# Altium schematic sheet Power.SchDoc
size Tabloid; DocumentNumber: 2; SheetNumber: 2; SheetTotal: 11; SheetName: Main power supply; Size: 11x17; Sheet_Name: Power
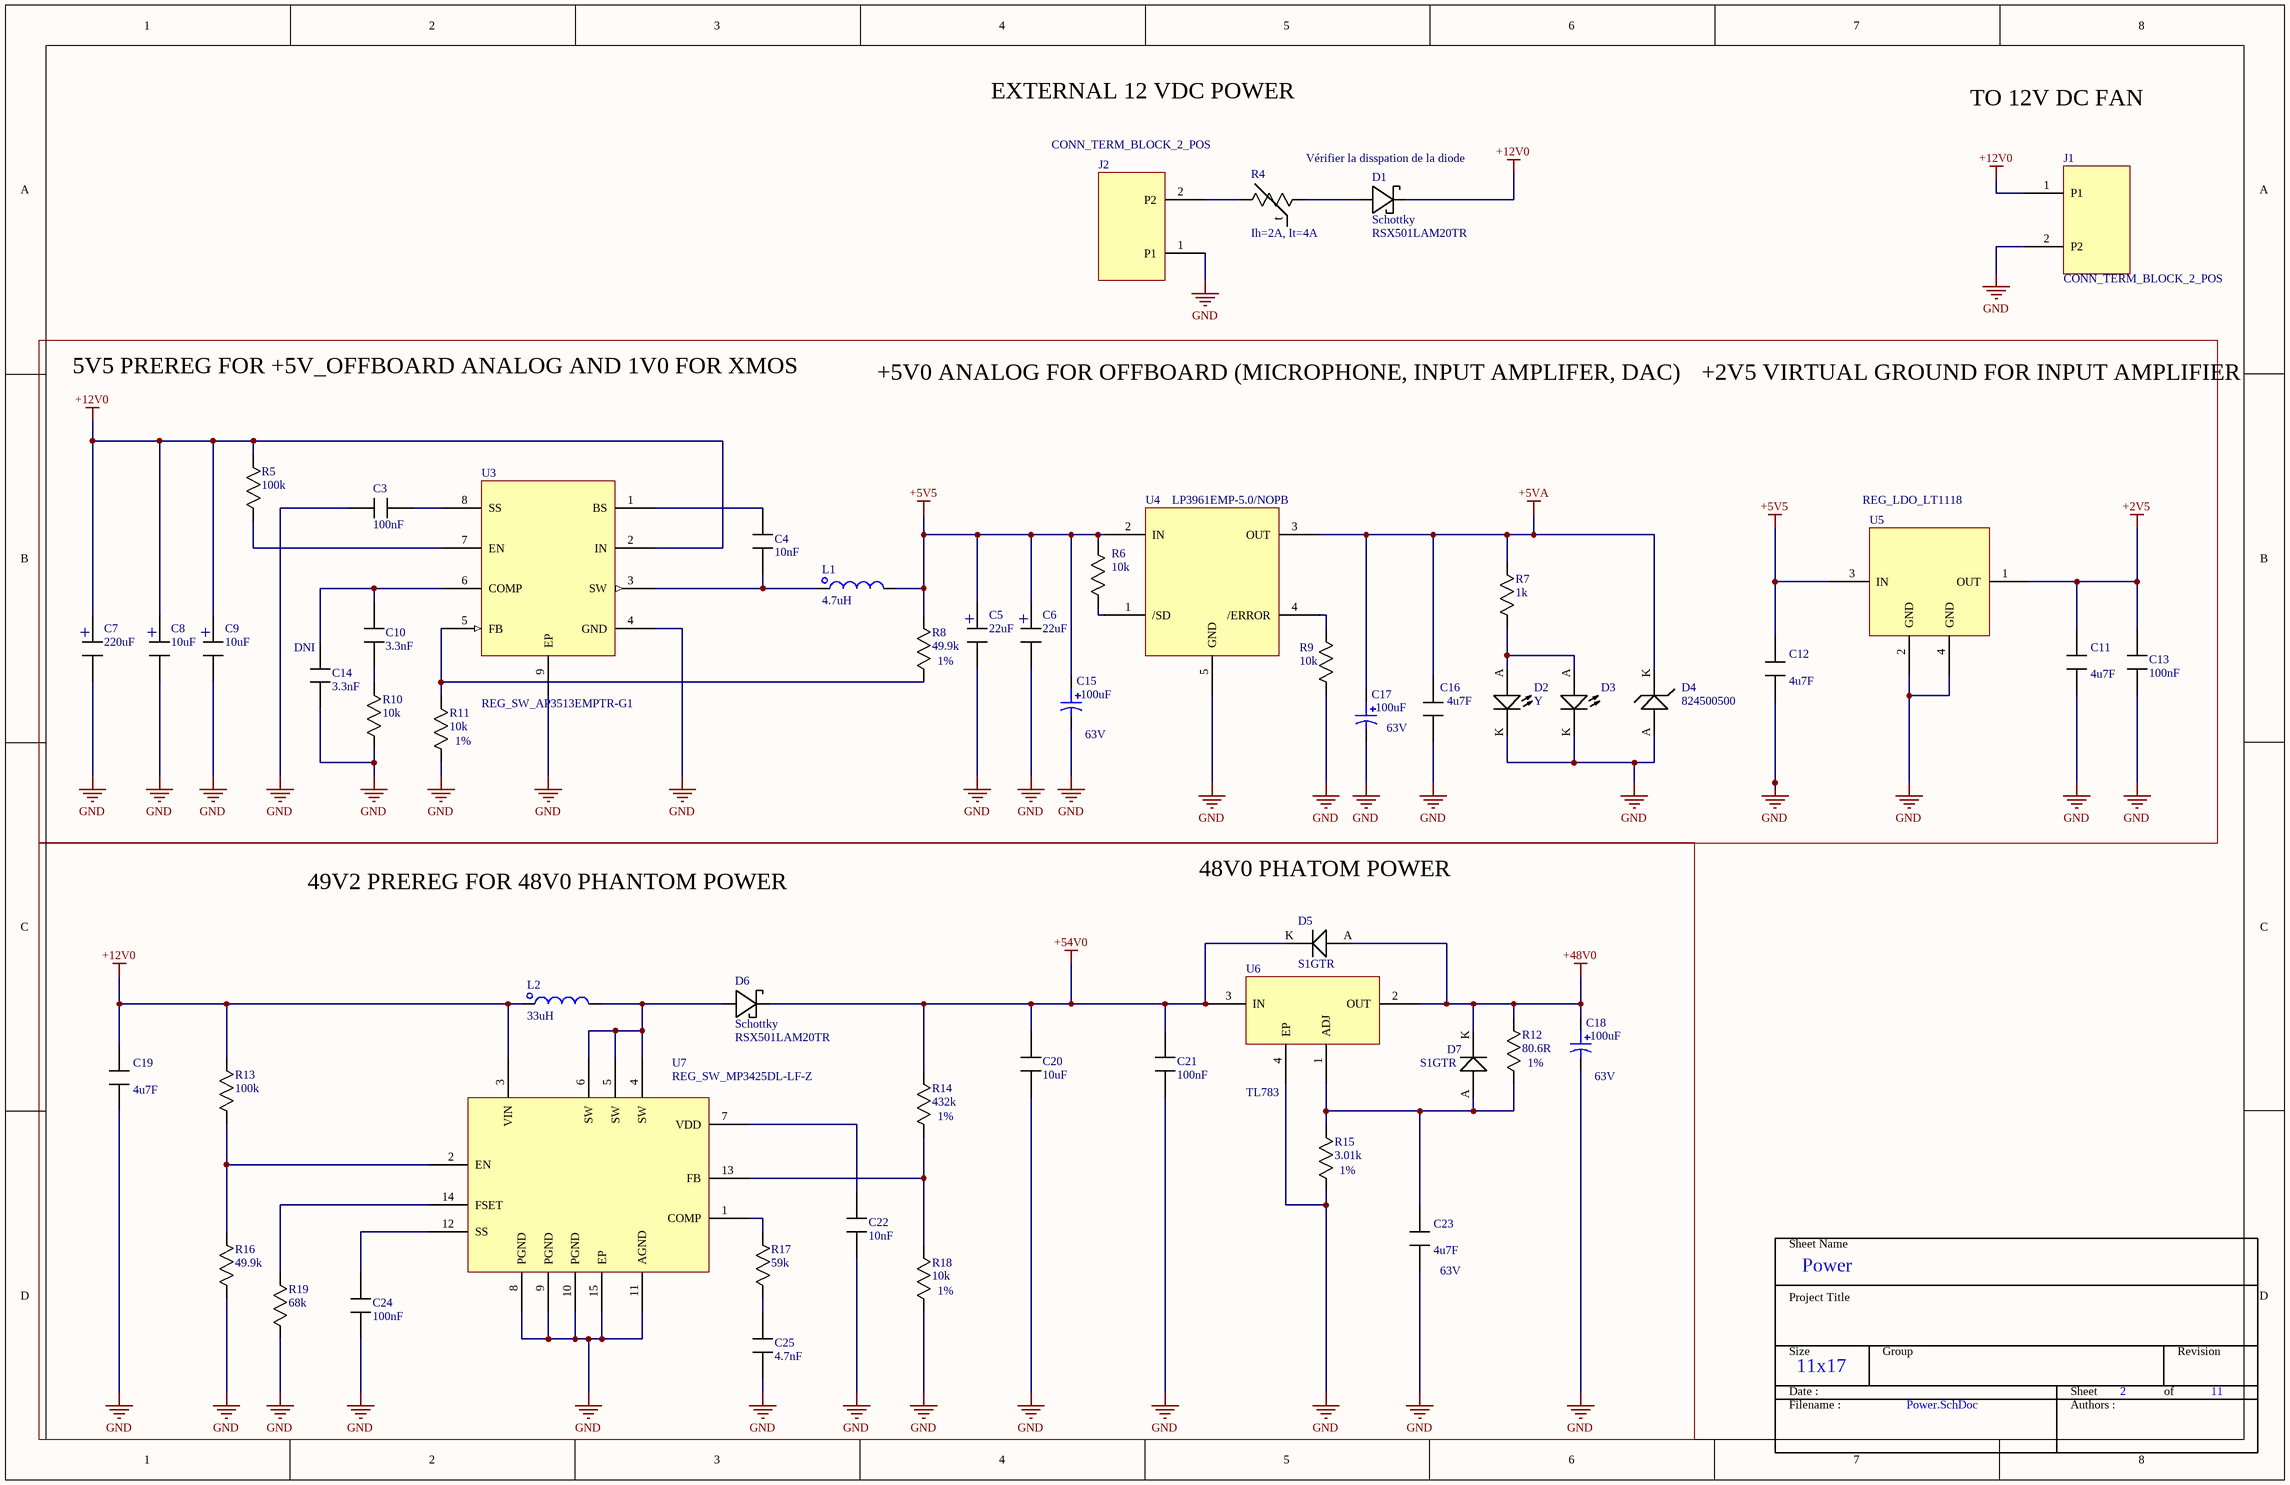
[diagram p0: Power.SchDoc]

## Parts
C3  value 100nF  [0603]  (hidden comment: Capacitor)
C4  value 10nF  [0603]  (hidden comment: Capacitor)
C5  value 22uF  [CAP_RAD_SMD_DIA157]  (hidden comment: Capacitor_Polarized)
C6  value 22uF  [CAP_RAD_SMD_DIA157]  (hidden comment: Capacitor_Polarized)
C7  value 220uF  [CAP_RAD_SMD_DIA315]  (hidden comment: Capacitor_Polarized)
C8  value 10uF  [CAP_RAD_SMD_DIA157]  (hidden comment: Capacitor_Polarized)
C9  value 10uF  [CAP_RAD_SMD_DIA157]  (hidden comment: Capacitor_Polarized)
C10  value 3.3nF  [0603]  (hidden comment: Capacitor)
C11  value 4u7F  [0805]  (hidden comment: Capacitor)
C12  value 4u7F  [0805]  (hidden comment: Capacitor)
C13  value 100nF  [0603]  (hidden comment: Capacitor)
C14  value 3.3nF  note: DNI  [0603]  (hidden comment: Capacitor)
C15  value 100uF  Voltage: 63V  [CAP_ALU_1010_vishay]  (hidden comment: MAL215099101E3)
C16  value 4u7F  [0603]  (hidden comment: Capacitor)
C17  value 100uF  Voltage: 63V  [CAP_ALU_1010_vishay]  (hidden comment: MAL215099101E3)
C18  value 100uF  Voltage: 63V  [CAP_ALU_1010_vishay]  (hidden comment: MAL215099101E3)
C19  value 4u7F  [0805]  (hidden comment: Capacitor)
C20  value 10uF  [CAP_1210]  (hidden comment: Capacitor)
C21  value 100nF  [0603]  (hidden comment: Capacitor)
C22  value 10nF  [0603]  (hidden comment: Capacitor)
C23  value 4u7F  voltage: 63V  [0603]  (hidden comment: Capacitor)
C24  value 100nF  [0603]  (hidden comment: Capacitor)
C25  value 4.7nF  [0603]  (hidden comment: Capacitor)
D1  Schottky  Mfg Part Number: RSX501LAM20TR  [SOD-123F]
D2  Type: Y  [0805_LED]  (hidden comment: Diode_LED)
D3  Diode_LED  [0805_LED]  (value not drawn)
D4  Mfg_PN: 824500500  [DIODE_DO-214AC/SMA]  (hidden comment: Diode_zener)
D5  Mfg_PN: S1GTR  [DIODE_SMA]  (hidden comment: Diode)
D6  Schottky  Mfg Part Number: RSX501LAM20TR  [SOD-123F]
D7  Mfg_PN: S1GTR  [DIODE_SMA]  (hidden comment: Diode)
J1  CONN_TERM_BLOCK_2_POS  [TERM BLOCK]
J2  CONN_TERM_BLOCK_2_POS  [TERM BLOCK]
L1  value 4.7uH  [IND_252012CDMC/DS]  (hidden comment: Inductor)
L2  value 33uH  [IND_252012CDMC/DS]  (hidden comment: Inductor)
R4  value Ih=2A, It=4A  [1206_PTC]  (hidden comment: Resistor_PTC)
R5  value 100k  [0603]  (hidden comment: Resistor)
R6  value 10k  [0603]  (hidden comment: Resistor)
R7  value 1k  [0603]  (hidden comment: Resistor)
R8  value 49.9k  Tolerance: 1%  [0603]  (hidden comment: Resistor)
R9  value 10k  [0603]  (hidden comment: Resistor)
R10  value 10k  [0603]  (hidden comment: Resistor)
R11  value 10k  Tolerance: 1%  [0603]  (hidden comment: Resistor)
R12  value 80.6R  Tolerance: 1%  [0603]  (hidden comment: Resistor)
R13  value 100k  [0603]  (hidden comment: Resistor)
R14  value 432k  Tolerance: 1%  [0603]  (hidden comment: Resistor)
R15  value 3.01k  Tolerance: 1%  [0603]  (hidden comment: Resistor)
R16  value 49.9k  [0603]  (hidden comment: Resistor)
R17  value 59k  [0603]  (hidden comment: Resistor)
R18  value 10k  Tolerance: 1%  [0603]  (hidden comment: Resistor)
R19  value 68k  [0603]  (hidden comment: Resistor)
U3  REG_SW_AP3513EMPTR-G1  [AP3513EMPTR-G1]
U4  LP3961EMP-5.0/NOPB  [TL783]
U5  REG_LDO_LT1118  [SOT-223-3]
U6  TL783  [TL783]
U7  REG_SW_MP3425DL-LF-Z  [14-VFDFN Exposed Pad]

## Nets
+2V5: C11.1 C13.2 U5.1(OUT)
+5V5: C5.+ C6.+ C12.1 C15.1 L1.2 R6.1 R8.1 U4.2(IN) U5.3(IN)
+5VA: C16.1 C17.1 D4.K R7.2 U4.3(OUT)
+12V0: C7.+ C8.+ C9.+ C19.1 D1.2(cathode) J1.1(P1) L2.1 R5.2 R13.2 U3.2(IN) U7.3(VIN)
+48V0: C18.1 D5.A D7.K R12.1 U6.2(OUT)
+54V0: C20.1 C21.2 D5.K D6.2(cathode) R14.1 U6.3(IN)
GND: C3.1 C5.- C6.- C7.- C8.- C9.- C11.2 C12.2 C13.1 C14.2 C15.2 C16.2 C17.2 C18.2 C19.2 C20.2 C21.1 C22.2 C23.2 C24.1 C25.2 D2.K D3.K D4.A J1.2(P2) J2.1(P1) R9.2 R10.2 R11.2 R15.2 R16.2 R18.2 R19.1 U3.4(GND) U3.9(EP) U4.5(GND) U5.2(GND) U5.4(GND) U6.4(EP) U7.8(PGND) U7.9(PGND) U7.10(PGND) U7.11(AGND) U7.15(EP)
NetC3_2: C3.2 U3.8(SS)
NetC4_1: C4.1 U3.1(BS)
NetC4_2: C4.2 L1.1 U3.3(SW)
NetC10_1: C10.1 C14.1 U3.6(COMP)
NetC10_2: C10.2 R10.1
NetC22_1: C22.1 U7.7(VDD)
NetC23_1: C23.1 D7.A R12.2 R15.1 U6.1(ADJ)
NetC24_2: C24.2 U7.12(SS)
NetC25_1: C25.1 R17.2
NetD1_1: D1.1(anode) R4.2
NetD2_A: D2.A D3.A R7.1
NetD6_1: D6.1(anode) L2.2 U7.4(SW) U7.5(SW) U7.6(SW)
NetJ2_2: J2.2(P2) R4.1
NetR5_1: R5.1 U3.7(EN)
NetR6_2: R6.2 U4.1(/SD)
NetR8_2: R8.2 R11.1 U3.5(FB)
NetR9_1: R9.1 U4.4(/ERROR)
NetR13_1: R13.1 R16.1 U7.2(EN)
NetR14_2: R14.2 R18.1 U7.13(FB)
NetR17_1: R17.1 U7.1(COMP)
NetR19_2: R19.2 U7.14(FSET)

## Notes on the sheet
- EXTERNAL 12 VDC POWER
- Vérifier la disspation de la diode
- TO 12V DC FAN
- 5V5 PREREG FOR +5V_OFFBOARD ANALOG AND 1V0 FOR XMOS
- +5V0 ANALOG FOR OFFBOARD (MICROPHONE, INPUT AMPLIFER, DAC)
- +2V5 VIRTUAL GROUND FOR INPUT AMPLIFIER
- 49V2 PREREG FOR 48V0 PHANTOM POWER
- 48V0 PHATOM POWER
- Sheet Name
- Project Title
- Size
- Group
- Revision
- Date :
- Filename :
- Sheet
- Authors :
- of
- (in symbol Resistor_PTC) t

## Library data of the parts
C3 C13 C24 = Capacitor: Mfg: Samsung; Mfg_PN: CL10F104ZO8NNNC; HelpURL: *; NI: NI; Supplier1: Digikey; Supplier1_PN: 1276-1258-1-ND; Tolerance: *; Type: *; Rating: *
C4 C22 = Capacitor: Mfg: Samsung; Mfg_PN: CL10B102KB8NNNC; HelpURL: https://www.digikey.ca/product-detail/en/samsung-electro-mechanics/CL10B102KB8NNNC/1276-1018-1-ND/3889104; NI: NI; Supplier1: Digikey; Supplier1_PN: 1276-1018-1-ND; Tolerance: *; Type: *; Rating: *
C5 = Capacitor_Polarized: Capacitor; Mfg: Panasonic; Mfg_PN: Part Number EEE-FT1V220AR; HelpURL: *; NI: *; Supplier1: Digikey; Supplier1_PN: PCE5012CT-ND; Tolerance: *; Type: *; Rating: *
C6 = Capacitor_Polarized: Capacitor; Mfg: Panasonic; Mfg_PN: EEE-FT1V220AR; HelpURL: *; NI: *; Supplier1: Digikey; Supplier1_PN: PCE5012CT-ND; Tolerance: *; Type: *; Rating: *
C7 = Capacitor_Polarized_1: Capacitor; Mfg: Nichicon; Mfg_PN: UWT1E221MNL1GS; HelpURL: *; NI: *; Supplier1: Digikey; Supplier1_PN: 493-2192-1-ND; Tolerance: *; Type: *; Rating: *
C8 C9 = Capacitor_Polarized: Capacitor; Mfg: Nichicon; Mfg_PN: UWX1C100MCL1GB; HelpURL: *; NI: *; Supplier1: Digikey; Supplier1_PN: 493-2100-1-ND; Tolerance: *; Type: *; Rating: *
C10 C14 = Capacitor: Mfg: Samsung; Mfg_PN: CL10B332JB8NNNC; HelpURL: *; NI: NI; Supplier1: Digikey; Supplier1_PN: 1276-2030-1-ND; Tolerance: *; Type: *; Rating: *
C11 C12 C16 C19 = Capacitor: Mfg: Samsung; Mfg_PN: CL21A475KAQNNNG; HelpURL: *; NI: *; Supplier1: Digikey; Supplier1_PN: 1276-6462-1-ND; Tolerance: *; Type: *; Rating: *
C15 C17 C18 = CAP_ALU_MAL215099101E3: CAP - ALU 100uF 20% 50V - 1010; Mfg Part Number: UUX1J101MNL1GS; Mfg: Nichicon; CreatedBy: Jonathan Bouchard; Temperature: -55°C to 125°C; Power: *; Supplier 1: Digikey; Supplier Part Number 1: 4399PHDKR-ND; Package: 1010; Precision: 20%; Supplier Part Number: *; Supplier Part Number: 493-7453-1-ND
C20 = Capacitor: Mfg: Samsung; Mfg_PN: CL32B106KMVNNWE; HelpURL: https://www.digikey.ca/product-detail/en/samsung-electro-mechanics/CL32B106KMVNNWE/1276-7053-1-ND/7320695; NI: NI; Supplier1: Digikey; Supplier1_PN: 1276-7053-1-ND; Tolerance: *; Type: *; Rating: *
C21 = Capacitor: Mfg: Walsin; Mfg_PN: 0603B104K101CT; HelpURL: *; NI: NI; Supplier1: Digikey; Supplier1_PN: 1292-1392-1-ND; Tolerance: *; Type: *; Rating: *
C23 = Capacitor: Mfg: Samsung; Mfg_PN: CL10A475MQ8NNNC; HelpURL: *; NI: *; Supplier1: Digikey; Supplier1_PN: 1276-1907-1-ND; Tolerance: *; Type: *; Rating: *
C25 = Capacitor: Mfg: Samsung; Mfg_PN: CL10B472KB8NNNC; HelpURL: https://www.digikey.ca/product-detail/en/samsung-electro-mechanics/CL10B472KB8NNNC/1276-1098-1-ND/3889184; NI: NI; Supplier1: Digikey; Supplier1_PN: 1276-1098-1-ND; Tolerance: *; Type: *; Rating: *
D1 = Schottky: Vf = 390mV, Vr = 20V; Current: 5A; Mfg: Rohm Semiconductor; CreatedBy: Emile Laplante; HelpURL: https://www.digikey.ca/product-detail/en/smc-diode-solutions/DSS16UTR/1655-1929-1-ND/8341871; NI: *; Package: *; Power: *; Supplier: Digikey; Supplier Part Numer: RSX501LAM20CT-ND; Temperature: *; Value: *; VerifiedBy: *; Voltage: *
D2 = Diode_LED: LED; Mfg: Osram; Mfg_PN: LY R976-PS-36; HelpURL: *; NI: *; Supplier1: Digikey; Supplier1_PN: 475-2560-1-ND; Tolerance: *; Rating: *; Value: *
D3 = Diode_LED: LED; Mfg: Osram; Mfg_PN: LY R976-PS-36; Type: Y; HelpURL: *; Supplier1: Digikey; Supplier1_PN: 475-2560-1-ND; Tolerance: *; Rating: *; Value: *
D4 = Diode_zener: Diode; Mfg: Wurth; HelpURL: *; NI: *; Supplier1: Digikey; Supplier1_PN: 732-9974-1-ND; Tolerance: *; Type: *; Rating: *; Value: *
D5 D7 = Diode: Mfg: SMC Diode Solutions; HelpURL: *; NI: *; Supplier1: Digikey; Supplier1_PN: 1655-1504-1-ND; Tolerance: *; Type: *; Rating: *; Value: *
D6 = Schottky: Vf = 390mV, Vr = 20V; Mfg: Rohm Semiconductor; CreatedBy: Emile Laplante; HelpURL: https://www.digikey.ca/product-detail/en/smc-diode-solutions/DSS16UTR/1655-1929-1-ND/8341871; NI: *; Package: *; Power: *; Supplier: Digikey; Supplier Part Numer: RSX501LAM20CT-ND; Temperature: *; Value: *; VerifiedBy: *; Voltage: *
L1 = Inductor: Mfg: Bourns Inc.; Mfg_PN: SRN5040-4R7M; HelpURL: *; NI: *; Rating: *; Tolerance: *; Supplier1: Digikey; Supplier1_PN: SRN5040-4R7MCT-ND
L2 = Inductor: Mfg: TDK Corporation; Mfg_PN: VLS5045EX-330M; HelpURL: https://www.digikey.ca/product-detail/en/tdk-corporation/VLS5045EX-330M/445-174851-1-ND/6560408; NI: *; Rating: *; Tolerance: *; Supplier1: Digikey; Supplier1_PN: 445-174851-1-ND
R4 = Resistor_PTC: Mfg: Littelfuse Inc.; Mfg_PN: 1206L150SLYR; NI: *; Supplier1: Digikey; Supplier1_PN: F3367CT-ND; Type: *; Rating: *; Tolerance: *
R5 R13 = Resistor: Mfg: Stackpole Electronics Inc; Mfg_PN: RMCF0603FT100K; HelpURL: https://www.digikey.ca/product-detail/en/stackpole-electronics-inc/RMCF0603FT100K/RMCF0603FT100KCT-ND/1943118; NI: *; Supplier1: Digikey; Supplier1_PN: RMCF0603FT100KCT-ND; Type: *; Rating: *; Tolerance: *
R6 R9 R10 = Resistor: Mfg: Yageo; Mfg_PN: RC0603JR-0710KL; HelpURL: *; NI: *; Supplier1: Digikey; Supplier1_PN: 311-10KGRCT-ND; Type: *; Rating: *; Tolerance: *
R7 = Resistor: Mfg: Yageo; Mfg_PN: RC0603JR-071KL; HelpURL: *; NI: *; Supplier1: Digikey; Supplier1_PN: 311-1.0KGRCT-ND; Type: *; Rating: *; Tolerance: *
R8 R16 = Resistor: Mfg: Yageo; Mfg_PN: RC0603FR-0749K9L; HelpURL: *; NI: *; Supplier1: Digikey; Supplier1_PN: 311-49.9KHRCT-ND; Type: *; Rating: *
  R16: Tolerance: *
R11 R18 = Resistor: Mfg: Stackpole Electronics Inc; Mfg_PN: RNCP0603FTD10K0; HelpURL: *; NI: *; Supplier1: Digikey; Supplier1_PN: RNCP0603FTD10K0CT-ND; Type: *; Rating: *
R12 = Resistor: Mfg: Stackpole Electronics Inc; Mfg_PN: RMCF0603FT80R6; HelpURL: *; NI: *; Supplier1: Digikey; Supplier1_PN: RMCF0603FT80R6CT-ND; Type: *; Rating: *
R14 = Resistor: Mfg: Yageo; Mfg_PN: RC0603FR-07432KL; HelpURL: *; NI: *; Supplier1: Digikey; Supplier1_PN: 311-432KHRCT-ND; Type: *; Rating: *
R15 = Resistor: Mfg: Panasonic Electronic Components; Mfg_PN: ERJ-3EKF3011V; HelpURL: *; NI: *; Supplier1: Digikey; Supplier1_PN: P3.01KHCT-ND; Type: *; Rating: *
R17 = Resistor: Mfg: Stackpole Electronics Inc; Mfg_PN: RMCF0603FT59K0; HelpURL: https://www.digikey.ca/product-detail/en/stackpole-electronics-inc/RMCF0603FT59K0/RMCF0603FT59K0CT-ND/4425114; NI: *; Supplier1: Digikey; Supplier1_PN: RMCF0603FT59K0CT-ND; Type: *; Rating: *; Tolerance: *
R19 = Resistor: Mfg: Yageo; Mfg_PN: RC0603FR-0768KL; HelpURL: https://www.digikey.ca/product-detail/en/yageo/RC0603FR-0768KL/311-68.0KHRCT-ND/730299; NI: *; Supplier1: Digikey; Supplier1_PN: 311-68.0KHRCT-ND; Type: *; Rating: *; Tolerance: *
U3 = REG_SW_AP3513EMPTR-G1: Mfg: Diodes Incorporated; CreatedBy: Emile Laplante; HelpURL: https://www.digikey.ca/product-detail/en/diodes-incorporated/AP3513EMPTR-G1/AP3513EMPTR-G1DICT-ND/4505181; Mfg Part Number: AP3513EMPTR-G1; NI: *; Power: *; Supplier: Digikey; Supplier Part Numer: AP3513EMPTR-G1DICT-ND; Temperature: *; Value: *; VerifiedBy: *; Voltage: *
U4 = LP3961EMP-5.0/NOPB: Mfg: Texas Instruments; CreatedBy: Emile Laplante; HelpURL: https://www.digikey.ca/product-detail/en/texas-instruments/LP3961EMP-5.0-NOPB/LP3961EMP-5.0-NOPBCT-ND/364674; Mfg Part Number: LP3961EMP-5.0/NOPB; NI: *; Package: *; Power: *; Supplier: Digikey; Supplier Part Numer: LP3961EMP-5.0/NOPBCT-ND; Temperature: *; Value: *; VerifiedBy: *; Voltage: *
U5 = REG_LDO_LT1118: Mfg Part Number: LT1118CST-2.5#PBF; Mfg: Linear Technology/Analog Devices; CreatedBy: Emile Laplante; HelpURL: https://www.digikey.ca/products/en?keywords=LT1118CST-2.5%23PBF; NI: *; Package: SOT-223-3; Power: *; Supplier: Digikey; Supplier Part Numer: LT1118CST-2.5#PBF-ND; Temperature: *; Value: *; VerifiedBy: *; Voltage: *
U6 = TL783: Mfg Part Number: TL783CKTTR; Mfg: Texas Instruments; CreatedBy: Emile Laplante; HelpURL: https://www.digikey.ca/product-detail/en/texas-instruments/TL783CKTTR/296-20778-1-ND/1204637; NI: *; Package: *; Power: *; Supplier: Digikey; Supplier Part Numer: 296-20778-1-ND; Temperature: *; Value: *; VerifiedBy: *; Voltage: *
U7 = REG_SW_MP3425DL-LF-Z: Mfg: Monolithic Power Systems Inc.; CreatedBy: Emile Laplante; HelpURL: https://www.digikey.ca/product-detail/en/monolithic-power-systems-inc/MP3425DL-LF-Z/1589-1643-1-ND/9433409; Mfg Part Number: MP3425DL-LF-Z; NI: *; Power: *; Supplier: Digikey; Supplier Part Numer: 1589-1643-1-ND; Temperature: *; Value: *; VerifiedBy: *; Voltage: *